# EAGLE design MechCherryMXTestBrd (EAGLE 8.0.1)
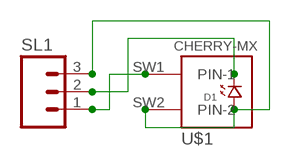
[diagram p0: schematic, sheet 1]

## Parts
D1  LED.0805  [0805.LED]
SL1  M03  [03P]
U$1  CHERRY-MX  [CHERRY-MX]

## Nets
N$1: D1.P$1 SL1.3 U$1.SW2(PIN-2)
N$2: SL1.1 U$1.SW1(PIN-1)
N$3: D1.P$2 SL1.2

## Library data of the parts
D1 = standardparts:LED
SL1 = con-amp-quick:M03: AMP QUICK CONNECTOR; OC_FARNELL: unknown; OC_NEWARK: unknown
U$1 = cherrymx:CHERRY-MX: Cherry MX series keyswitch

## Board
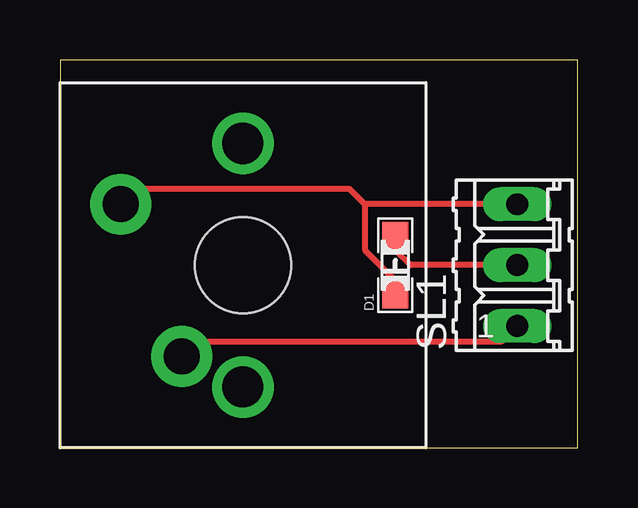
[diagram p1: board, top side]

Size 21.57 x 16.18 mm. Coordinates in mm from the lower left corner, seen from the top.
Outline: 0,0 21.57,0 21.57,16.18 0,16.18 0,0
Copper layers (1*2): Top 0.035mm / dielectric 1.5mm / Route2 0.035mm
Design rules "default *": minimum track width 10mil, minimum drill 24mil, track to track 8mil, track to pad 8mil, pad to pad 8mil, via to via 8mil, smd to smd 8mil, copper to edge 40mil, drill to drill 8mil, minimum pad ring 10mil, minimum via ring 8mil, stop-mask expansion 4mil, vias tented up to drill 0mil, thermal gap 10mil

### Footprints (pad centres in the part's own frame; a part is rotated, then mirrored left to right if it is on the bottom)
0805.LED = smd 1.25 x 1.1: P$1 -1.175,0; P$2 1.175,0
03P = drill 0.914 long: 1 -2.54,0; 2 0,0; 3 2.54,0
CHERRY-MX = drill 1.714 pad 1.93: P$3 -5.08,0; P$4 5.08,0 | drill 1.5 pad 2.54: SW1 -3.81,2.54; SW2 2.54,5.08 | hole 4: 0,0

### Placement (x,y rotation side)
D1  13.97,7.62 90 top
SL1  19.05,7.62 90 top
U$1  7.62,7.62 90 top

### Tracks (layer width: path | path; a pad name or v marks a point on that pad's centre or on a via)
N$1
  Top 0.254: 12.7,10.16 12.7,8.26 13.97,6.99 D1.P$1 | SL1.3 12.7,10.16 | U$1.SW2 3.17,10.79 12.06,10.79 12.7,10.16
N$2
  Top 0.254: SL1.1 18.41,4.45 5.71,4.45 U$1.SW1
N$3
  Top 0.254: SL1.2 14.61,7.62 13.97,8.26 D1.P$2